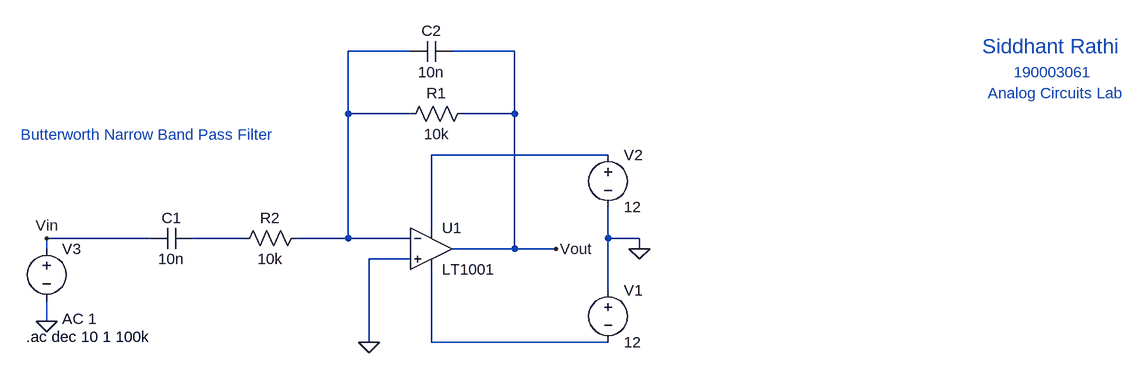
[diagram p0: schematic Butterworth Narrow BPF.asc]
Butterworth Narrow BPF.asc, the LTspice schematic file:
Version 4
SHEET 1 1756 680
WIRE -208 -32 -304 -32
WIRE -48 -32 -144 -32
WIRE -304 64 -304 -32
WIRE -208 64 -304 64
WIRE -48 64 -48 -32
WIRE -48 64 -128 64
WIRE 96 128 -176 128
WIRE -176 240 -176 128
WIRE -608 256 -768 256
WIRE -464 256 -544 256
WIRE -304 256 -304 64
WIRE -304 256 -384 256
WIRE -208 256 -304 256
WIRE 96 256 96 208
WIRE 144 256 96 256
WIRE -768 272 -768 256
WIRE -48 272 -48 64
WIRE -48 272 -144 272
WIRE 16 272 -48 272
WIRE 144 272 144 256
WIRE -208 288 -272 288
WIRE 96 336 96 256
WIRE -768 384 -768 352
WIRE -272 416 -272 288
WIRE -176 416 -176 304
WIRE 96 416 -176 416
FLAG -768 384 0
FLAG -272 416 0
FLAG -768 256 Vin
FLAG 144 272 0
FLAG 16 272 Vout
SYMBOL OpAmps\\LT1001 -176 208 R0
SYMATTR InstName U1
SYMBOL res -112 48 R90
WINDOW 0 0 56 VBottom 2
WINDOW 3 32 56 VTop 2
SYMATTR InstName R1
SYMATTR Value 10k
SYMBOL res -368 240 R90
WINDOW 0 0 56 VBottom 2
WINDOW 3 32 56 VTop 2
SYMATTR InstName R2
SYMATTR Value 10k
SYMBOL voltage 96 320 R0
WINDOW 123 0 0 Left 0
WINDOW 39 0 0 Left 0
SYMATTR InstName V1
SYMATTR Value 12
SYMBOL voltage 96 112 R0
WINDOW 123 0 0 Left 0
WINDOW 39 0 0 Left 0
SYMATTR InstName V2
SYMATTR Value 12
SYMBOL voltage -768 256 R0
WINDOW 123 24 124 Left 2
WINDOW 39 0 0 Left 0
SYMATTR Value2 AC 1
SYMATTR InstName V3
SYMATTR Value ""
SYMBOL cap -544 240 R90
WINDOW 0 0 32 VBottom 2
WINDOW 3 32 32 VTop 2
SYMATTR InstName C1
SYMATTR Value 10n
SYMBOL cap -144 -48 R90
WINDOW 0 0 32 VBottom 2
WINDOW 3 32 32 VTop 2
SYMATTR InstName C2
SYMATTR Value 10n
TEXT -808 96 Left 2 ;Butterworth Narrow Band Pass Filter
TEXT -800 408 Left 2 !.ac dec 10 1 100k
TEXT 672 -40 Left 3 ;Siddhant Rathi
TEXT 720 0 Left 2 ;190003061
TEXT 680 32 Left 2 ;Analog Circuits Lab

The netlist it stands for:
* Butterworth Narrow BPF.asc
XU1 0 N001 N002 N004 Vout LT1001  ; pins In+ In- V+ V- OUT
R1 Vout N001 10k
R2 N001 N003 10k
V1 0 N004 12
V2 N002 0 12
V3 Vin 0 AC 1
C1 N003 Vin 10n
C2 Vout N001 10n
* Butterworth Narrow Band Pass Filter
.ac dec 10 1 100k
* Siddhant Rathi
* 190003061
* Analog Circuits Lab
.lib LTC.lib
.backanno
.end